# EAGLE design untitled (EAGLE 6.1)
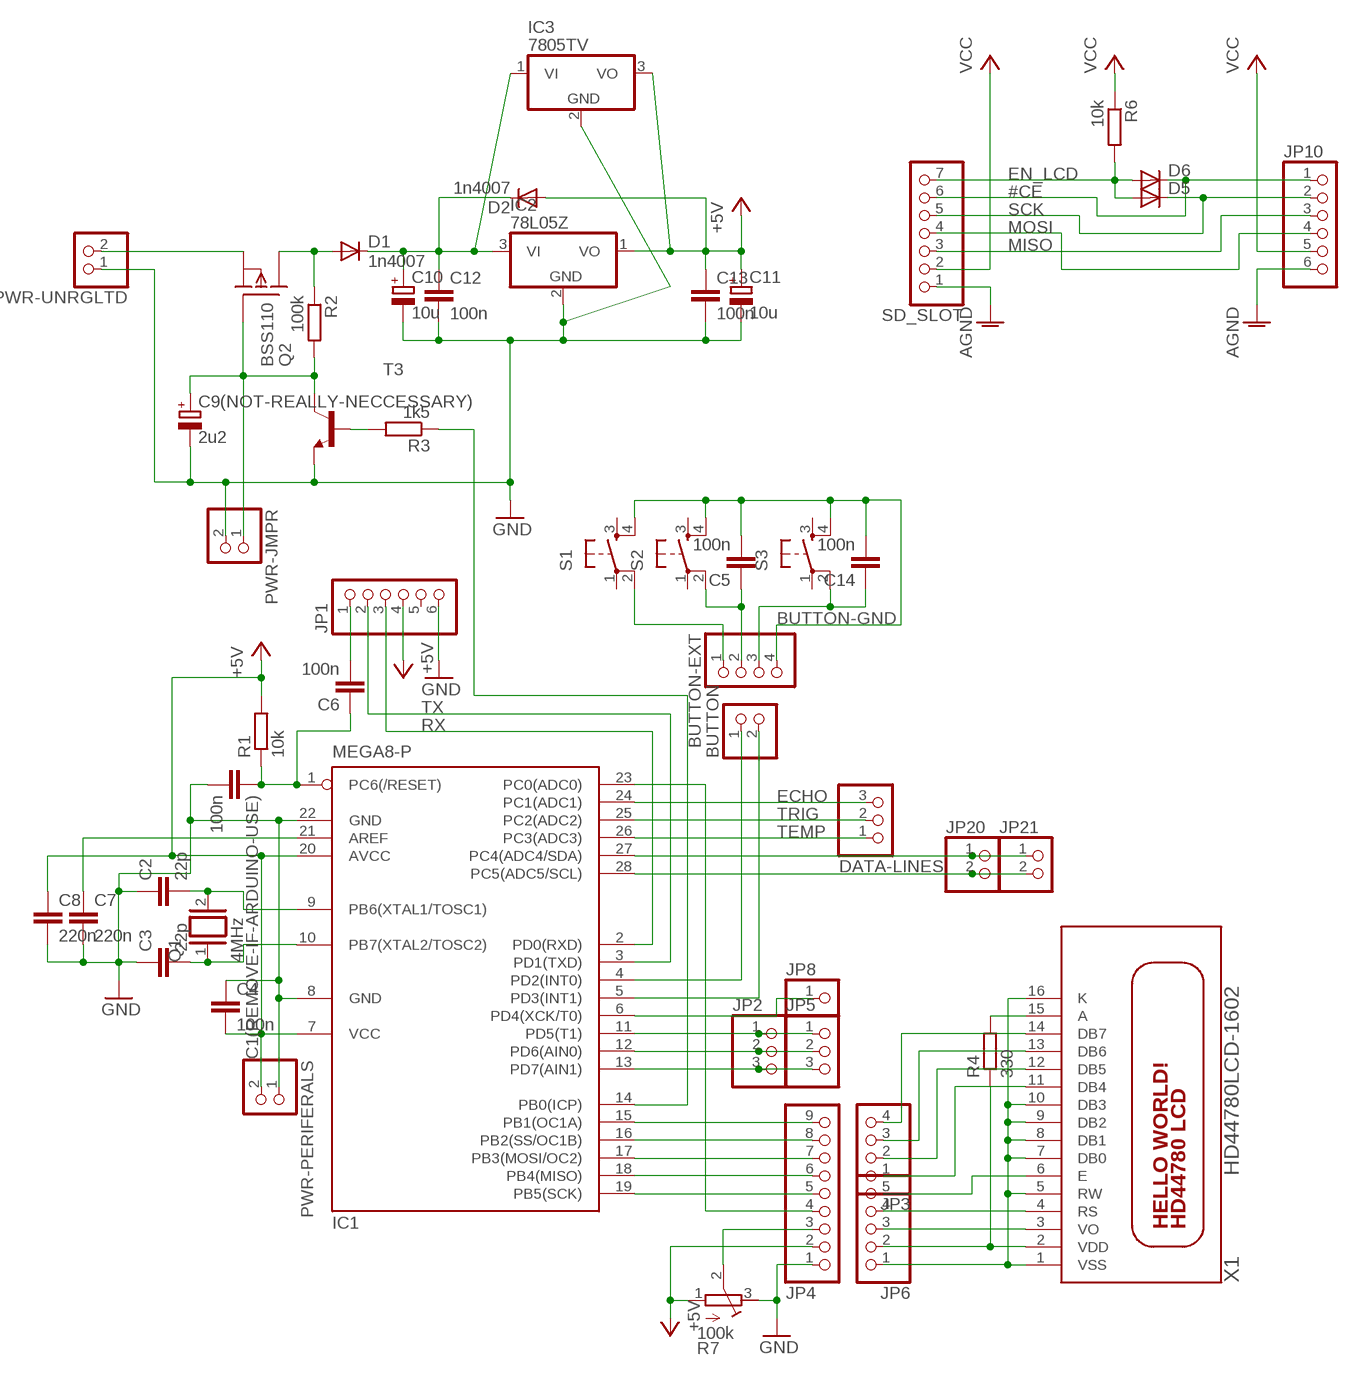
[diagram p0: schematic, sheet 1]

## Parts
BUTTON  PINHD-1X2  [1X02]
BUTTON-EXT  PINHD-1X4  [1X04]
C1(REMOVE-IF-ARDUINO-USE)  100n  C-EU025-025X050  [C025-025X050]
C2  22p  C-EU025-025X050  [C025-025X050]
C3  22p  C-EU025-025X050  [C025-025X050]
C4  100n  C-EU025-025X050  [C025-025X050]
C5  100n  C-EU025-025X050  [C025-025X050]
C6  100n  C-EU025-025X050  [C025-025X050]
C7  220n  C-EU025-025X050  [C025-025X050]
C8  220n  C-EU025-025X050  [C025-025X050]
C9(NOT-REALLY-NECCESSARY)  2u2  CPOL-EUE2.5-6  [E2,5-6]
C10  10u  CPOL-EUE2.5-6  [E2,5-6]
C11  10u  CPOL-EUE5-9VAXIAL  [E5R]
C12  100n  C-EU025-025X050  [C025-025X050]
C13  100n  C-EU025-025X050  [C025-025X050]
C14  100n  C-EU025-025X050  [C025-025X050]
D1  1n4007  DIODE-D-2.5  [D-2.5]
D2  1n4007  DIODE-D-2.5  [D-2.5]
D5  DIODE-D-5  [D-5]
D6  DIODE-D-2.5  [D-2.5]
DATA-LINES  PINHD-1X3  [1X03]
IC1  MEGA8-P  [DIL28-3]
IC2  78L05Z  [TO92]
IC3  7805TV  [TO220V]
JP1  PINHD-1X6  [1X06]
JP2  PINHD-1X3  [1X03]
JP3  PINHD-1X4  [1X04]
JP4  PINHD-1X9  [1X09]
JP5  PINHD-1X3  [1X03]
JP6  PINHD-1X5  [1X05]
JP8  PINHD-1X1  [1X01]
JP10  PINHD-1X6  [1X06]
JP20  PINHD-1X2  [1X02]
JP21  PINHD-1X2  [1X02]
PWR-JMPR  PINHD-1X2  [1X02]
PWR-PERIFERALS  PINHD-1X2  [1X02]
PWR-UNRGLTD  PINHD-1X2  [1X02]
Q1  4MHz  XTAL/S  [QS]
Q2  BSS110  [TO92]
R1  10k  R-EU_0207/2V  [0207/2V]
R2  100k  R-EU_0207/2V  [0207/2V]
R3  1k5  R-EU_0207/2V  [0207/2V]
R4  330  R-EU_0207/10  [0207/10]
R6  10k  R-EU_0207/12  [0207/12]
R7  100k  R-TRIMM64W  [RTRIM64W]
S1  TAC_SWITCHPTH  [TACTILE-PTH]
S2  TAC_SWITCHPTH  [TACTILE-PTH]
S3  TAC_SWITCHPTH  [TACTILE-PTH]
SD_SLOT  PINHD-1X7  [1X07]
T3  BC167-NPN-TO92-ECB  [TO92-ECB]
X1  HD44780LCD-1602  [LCD1602]

## Nets
#CE: D6.C JP10.1 SD_SLOT.6
+5V: C4.2 C8.1 C11.+ C13.1 D2.A IC1.7(VCC) IC1.20(AVCC) IC2.1(VO) IC3.3(VO) JP1.4 JP4.2 PWR-PERIFERALS.2 R1.2 R7.1(A)
AGND: JP10.6 SD_SLOT.1
BUTTON-GND: BUTTON-EXT.4 C5.2 C14.2 S1.4 S2.4 S3.4
ECHO: DATA-LINES.3 IC1.24(PC1(ADC1))
EN_LCD: D5.A D6.A R6.2 SD_SLOT.7
GND: C1(REMOVE-IF-ARDUINO-USE).2 C2.1 C3.1 C4.1 C7.2 C8.2 C9(NOT-REALLY-NECCESSARY).- C10.- C11.- C12.2 C13.2 IC1.8(GND) IC1.22(GND) IC2.2(GND) IC3.2(GND) JP1.6 JP4.1 PWR-JMPR.2 PWR-PERIFERALS.1 PWR-UNRGLTD.1 R7.3(E) T3.E
MISO: JP10.3 SD_SLOT.3
MOSI: JP10.4 SD_SLOT.4
N$1: C6.2 JP1.1
N$2: JP4.3 R7.2(S)
N$3: R4.2 X1.15(A)
N$4: JP3.2 X1.12(DB5)
N$5: JP3.3 X1.13(DB6)
N$6: JP3.4 X1.14(DB7)
N$7: JP3.1 X1.11(DB4)
N$8: JP6.5 X1.6(E)
N$9: IC1.15(PB1(OC1A)) JP4.9
N$10: JP6.4 X1.4(RS)
N$11: JP6.3 X1.3(VO)
N$12: IC1.16(PB2(SS/OC1B)) JP4.8
N$13: IC1.17(PB3(MOSI/OC2)) JP4.7
N$14: IC1.18(PB4(MISO)) JP4.6
N$15: IC1.19(PB5(SCK)) JP4.5
N$16: IC1.23(PC0(ADC0)) JP4.4
N$17: C1(REMOVE-IF-ARDUINO-USE).1 C6.1 IC1.1(PC6(/RESET)) R1.1
N$19: BUTTON.1 IC1.4(PD2(INT0))
N$20: C2.2 IC1.9(PB6(XTAL1/TOSC1)) Q1.2
N$21: C3.2 IC1.10(PB7(XTAL2/TOSC2)) Q1.1
N$22: IC1.13(PD7(AIN1)) JP2.3 JP5.3
N$23: IC1.12(PD6(AIN0)) JP2.2 JP5.2
N$24: C7.1 IC1.21(AREF)
N$25: IC1.11(PD5(T1)) JP2.1 JP5.1
N$27: C9(NOT-REALLY-NECCESSARY).+ PWR-JMPR.1 Q2.2(G) R2.2 T3.C
N$28: R3.2 T3.B
N$29: BUTTON.2 IC1.5(PD3(INT1))
N$30: PWR-UNRGLTD.2 Q2.1(S)
N$31: D1.A Q2.3(D) R2.1
N$32: BUTTON-EXT.3 C14.1 S3.2
N$35: IC1.27(PC4(ADC4/SDA)) JP20.1 JP21.1
N$36: IC1.28(PC5(ADC5/SCL)) JP20.2 JP21.2
N$37: C10.+ C12.1 D1.C D2.C IC2.3(VI) IC3.1(VI)
N$40: IC1.6(PD4(XCK/T0)) JP8.1
N$42: BUTTON-EXT.2 C5.1 S2.2
N$43: IC1.14(PB0(ICP)) R3.1
N$46: BUTTON-EXT.1 S1.2
RX: IC1.2(PD0(RXD)) JP1.3
SCK: D5.C JP10.2 SD_SLOT.5
TEMP: DATA-LINES.1 IC1.26(PC3(ADC3))
TRIG: DATA-LINES.2 IC1.25(PC2(ADC2))
TX: IC1.3(PD1(TXD)) JP1.2
VCC: JP10.5 R6.1 SD_SLOT.2
VDD: JP6.2 R4.1 X1.2(VDD)
VSS: JP6.1 X1.1(VSS) X1.5(RW) X1.7(DB0) X1.8(DB1) X1.9(DB2) X1.10(DB3) X1.16(K)
Unconnected: JP1.5 S1.1 S1.3 S2.1 S2.3 S3.1 S3.3

## Library data of the parts
BUTTON JP20 JP21 PWR-JMPR PWR-PERIFERALS PWR-UNRGLTD = pinhead:PINHD-1X2: PIN HEADER
BUTTON-EXT JP3 = pinhead:PINHD-1X4: PIN HEADER
C1(REMOVE-IF-ARDUINO-USE) C2-C8 C12-C14 = rcl:C-EU: CAPACITOR, European symbol
C9(NOT-REALLY-NECCESSARY) C10 C11 = rcl:CPOL-EU: POLARIZED CAPACITOR, European symbol
D1 D2 D5 D6 = diode:DIODE-: DIODE
DATA-LINES JP2 JP5 = pinhead:PINHD-1X3: PIN HEADER
IC1 = atmel:MEGA8-P: MICROCONTROLLER 8 Kbytes FLASH, 1 kbytes SRAM, 512 bytes EEPROM, USART, 4-channel 10 bit ADC, 2-channel 8 bit ADC Pin compatible with Atmega48, ATMega88, ATMega168 Source: avr.lbr; OC_FARNELL: unknown; OC_NEWARK: unknown
IC2 IC3 = linear:78*: Positive VOLTAGE REGULATOR Source: http://cache.national.com/ds/LM/LM78L05.pdf http://www.fairchildsemi.com/ds/LM/LM7805.pdf
JP1 JP10 = pinhead:PINHD-1X6: PIN HEADER
JP4 = pinhead:PINHD-1X9: PIN HEADER
JP6 = pinhead:PINHD-1X5: PIN HEADER
JP8 = pinhead:PINHD-1X1: PIN HEADER
Q1 = special:XTAL/S: CRYSTAL
Q2 = transistor-fet:BSS110: P-Channel Enhancement MOSFET -50V; -0,17A; 6Ohm
R1-R4 R6 = rcl:R-EU_: RESISTOR, European symbol
R7 = rcl:R-TRIMM: Trimm resistor
S1-S3 = SparkFun:TAC_SWITCH: Momentary Switch Button commonly used for reset or general input. Spark Fun Electronics SKU : COM-00097
SD_SLOT = pinhead:PINHD-1X7: PIN HEADER
T3 = transistor:*-NPN-: NPN Transistror BF959 corrected 2008.03.06
X1 = adafruit:HD44780LCD: HD44780 LCD Standard character type LCDs, available in sizes from 8x1 to 40x4!

## Board
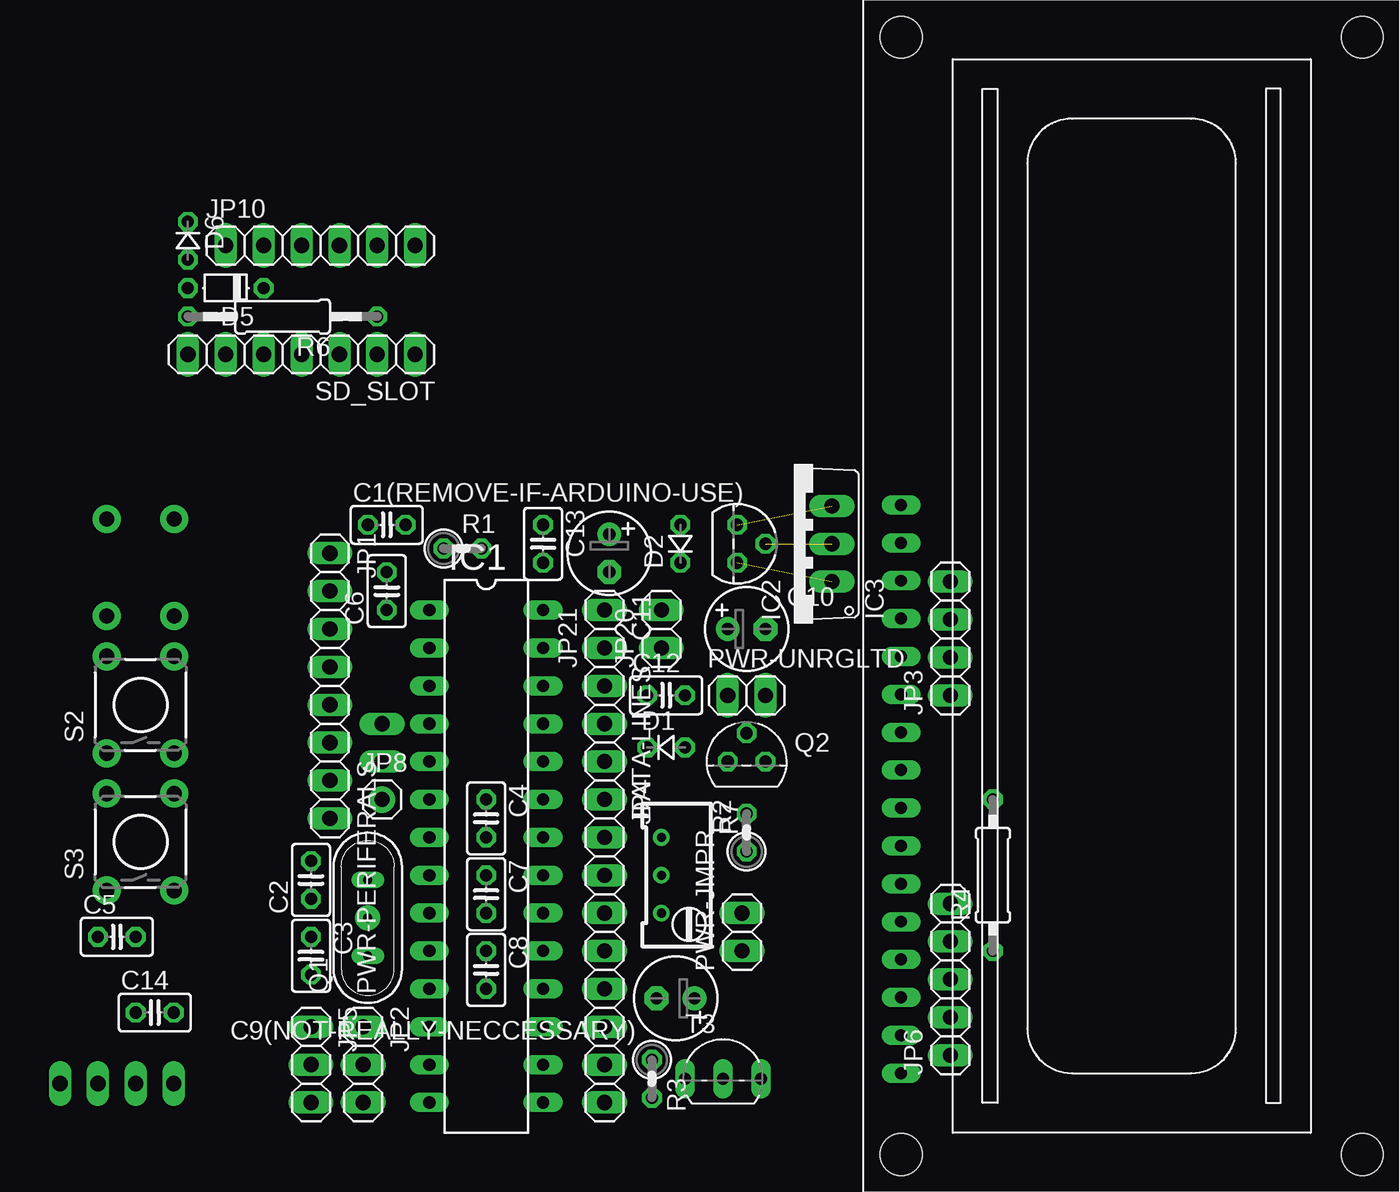
[diagram p1: board, top side]
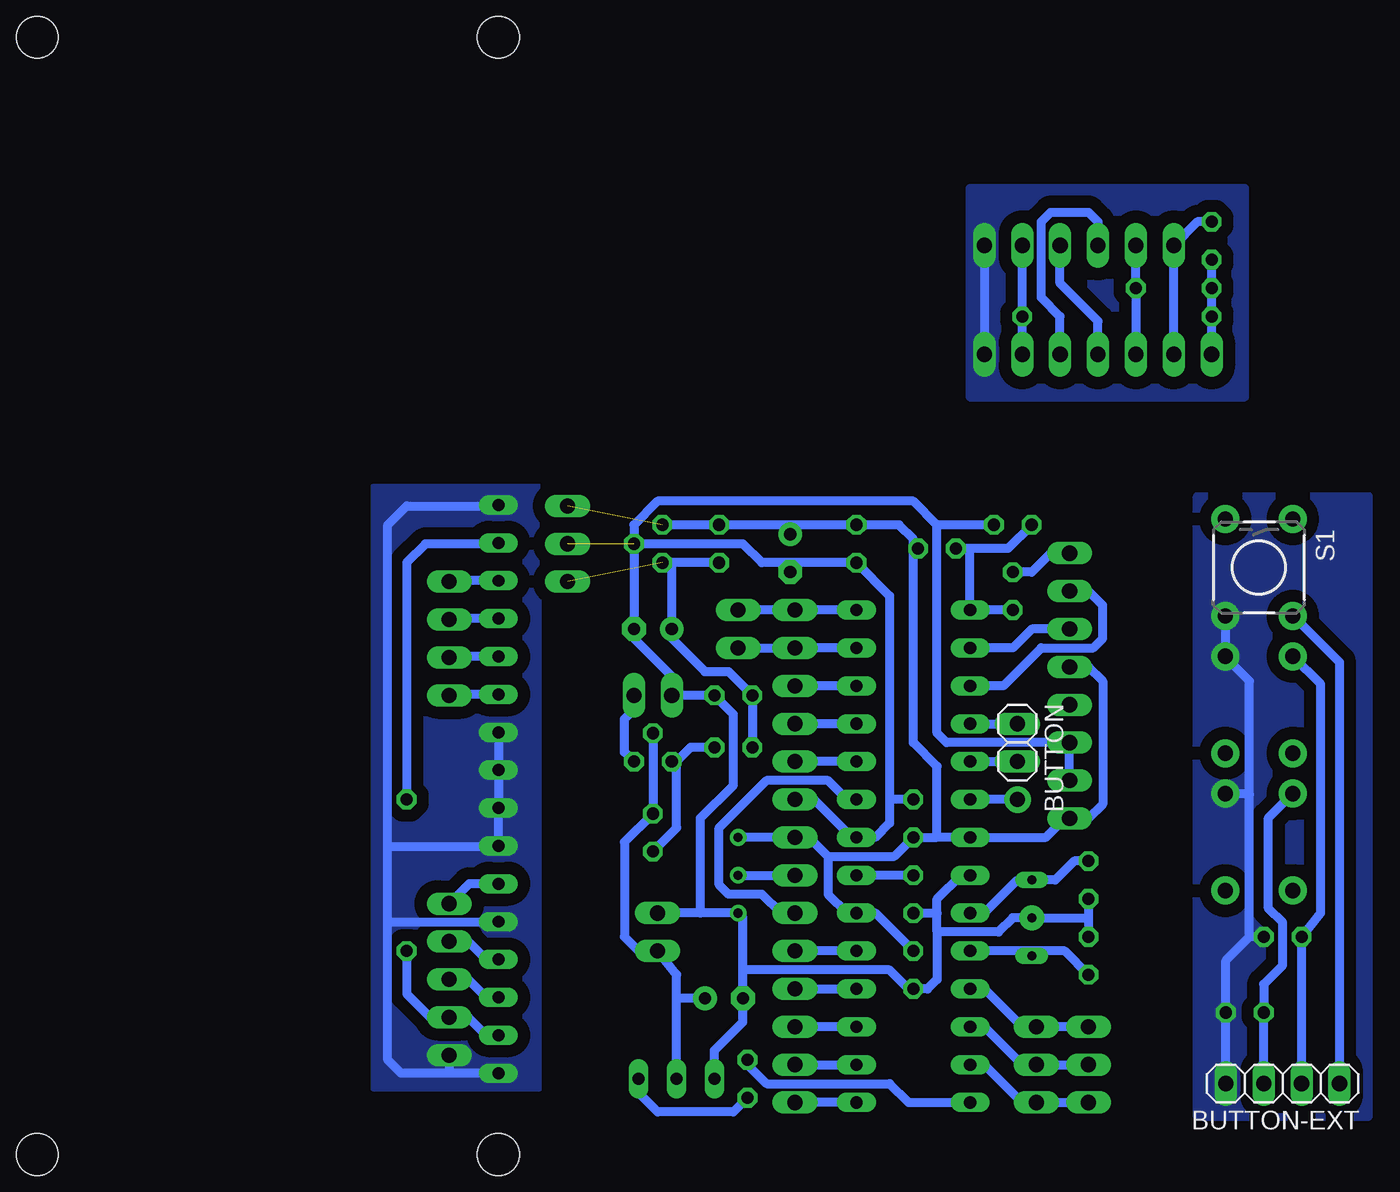
[diagram p2: board, bottom side, seen from below]

No outline drawn. Coordinates in mm, seen from the top.
Copper layers (1*16): Top 0.035mm / dielectric 1.5mm / Bottom 0.035mm
Design rules: minimum track width 10mil, minimum drill 24mil, track to track 8mil, track to pad 8mil, pad to pad 8mil, via to via 8mil, smd to smd 8mil, copper to edge 40mil, drill to drill 8mil, minimum pad ring 10mil, minimum via ring 8mil, stop-mask expansion 4mil, vias tented up to drill 0mil, thermal gap 10mil

### Footprints (pad centres in the part's own frame; a part is rotated, then mirrored left to right if it is on the bottom)
1X02 = drill 1.016 long: 1 -1.27,0; 2 1.27,0
1X04 = drill 1.016 long: 1 -3.81,0; 2 -1.27,0; 3 1.27,0; 4 3.81,0
C025-025X050 = drill 0.813 octagon: 1 -1.27,0; 2 1.27,0
E2,5-6 = drill 0.813 pad 1.6: + -1.27,0 | drill 0.813 pad 1.6 octagon: - 1.27,0
D-2.5 = drill 0.813 octagon: A 1.27,0; C -1.27,0
D-5 = drill 0.813 octagon: A 2.54,0; C -2.54,0
1X03 = drill 1.016 long: 1 -2.54,0; 2 0,0; 3 2.54,0
DIL28-3 = drill 0.813 long: 1 -16.51,-3.81; 2 -13.97,-3.81; 3 -11.43,-3.81; 4 -8.89,-3.81; 5 -6.35,-3.81; 6 -3.81,-3.81; 7 -1.27,-3.81; 8 1.27,-3.81; 9 3.81,-3.81; 10 6.35,-3.81; 11 8.89,-3.81; 12 11.43,-3.81; 13 13.97,-3.81; 14 16.51,-3.81; 15 16.51,3.81; 16 13.97,3.81; 17 11.43,3.81; 18 8.89,3.81; 19 6.35,3.81; 20 3.81,3.81; 21 1.27,3.81; 22 -1.27,3.81; 23 -3.81,3.81; 24 -6.35,3.81; 25 -8.89,3.81; 26 -11.43,3.81; 27 -13.97,3.81; 28 -16.51,3.81
TO92 = drill 0.813 octagon: 1 -1.27,0; 2 0,1.905; 3 1.27,0
TO220V = drill 1.016 long: 1 -2.54,-2.54; 2 0,-2.54; 3 2.54,-2.54
1X06 = drill 1.016 long: 1 -6.35,0; 2 -3.81,0; 3 -1.27,0; 4 1.27,0; 5 3.81,0; 6 6.35,0
1X09 = drill 1.016 long: 1 -10.16,0; 2 -7.62,0; 3 -5.08,0; 4 -2.54,0; 5 0,0; 6 2.54,0; 7 5.08,0; 8 7.62,0; 9 10.16,0
1X05 = drill 1.016 long: 1 -5.08,0; 2 -2.54,0; 3 0,0; 4 2.54,0; 5 5.08,0
1X01 = drill 1.016 octagon: 1 0,0
QS = drill 0.61 long: 1 -2.54,0; 2 2.54,0
TO92' = drill 0.813 octagon: 1 1.27,0; 2 0,1.905; 3 -1.27,0
0207/2V = drill 0.813 octagon: 1 -1.27,0; 2 1.27,0
0207/10 = drill 0.813 octagon: 1 -5.08,0; 2 5.08,0
0207/12 = drill 0.813 octagon: 1 -6.35,0; 2 6.35,0
RTRIM64W = drill 0.61: 1 1.27,-2.54; 2 1.27,0; 3 1.27,2.54
TACTILE-PTH = drill 1.016 pad 1.88: 1 -3.251,2.261; 2 3.251,2.261; 3 -3.251,-2.261; 4 3.251,-2.261
1X07 = drill 1.016 long: 1 -7.62,0; 2 -5.08,0; 3 -2.54,0; 4 0,0; 5 2.54,0; 6 5.08,0; 7 7.62,0
TO92-ECB = drill 0.813 long: B 2.54,0; C 0,0; E -2.54,0
LCD1602 = drill 0.8 long: 1 8,33.46; 2 10.54,33.46; 3 13.08,33.46; 4 15.62,33.46; 5 18.16,33.46; 6 20.7,33.46; 7 23.24,33.46; 8 25.78,33.46; 9 28.32,33.46; 10 30.86,33.46; 11 33.4,33.46; 12 35.94,33.46; 13 38.48,33.46; 14 41.02,33.46; 15 43.56,33.46; 16 46.1,33.46 | hole 2.8: 2.54,2.54; 2.54,33.46; 77.46,33.46; 77.46,2.54

### Placement (x,y rotation side)
BUTTON  63.5,40.96 270 bottom
BUTTON-EXT  45.72,18.1 180 bottom
C1(REMOVE-IF-ARDUINO-USE)  63.82,55.56 0 top
C2  58.74,31.75 90 top
C3  58.74,26.67 270 top
C4  70.48,35.88 270 top
C5  45.72,27.94 0 top
C6  63.82,51.12 90 top
C7  70.48,30.8 270 top
C8  70.48,25.72 270 top
C9(NOT-REALLY-NECCESSARY)  83.19,23.81 180 top
C10  87.95,48.58 0 top
C11  10u  [E2,5-6]  78.74,53.66 270 top
C12  82.55,44.13 0 top
C13  74.3,54.29 270 top
C14  48.26,22.86 0 top
D1  82.55,40.64 0 top
D2  83.5,54.29 90 top
D5  53.02,71.44 180 top
D6  50.48,74.61 270 top
DATA-LINES  78.42,42.23 270 top
IC1  70.48,33.34 270 top
IC2  87.31,54.29 270 top
IC3  91.12,54.29 90 top
JP1  60.01,47.31 270 top
JP2  62.23,19.37 270 top
JP3  101.6,47.94 90 top
JP4  78.42,26.99 270 top
JP5  58.74,19.37 270 top
JP6  101.6,25.08 90 top
JP8  63.5,37.15 0 top
JP10  59.37,74.3 0 top
JP20  82.23,48.58 90 top
JP21  78.42,48.58 90 top
PWR-JMPR  87.63,28.26 90 top
PWR-PERIFERALS  60.01,37.15 270 top
PWR-UNRGLTD  87.95,44.13 0 top
Q1  62.55,29.21 90 top
Q2  BSS110  [TO92']  87.95,39.69 0 top
R1  68.9,53.98 0 top
R2  87.95,34.92 90 top
R3  81.6,18.41 270 top
R4  104.46,32.07 90 top
R6  56.83,69.53 180 top
R7  83.5,32.07 180 top
S1  47.31,52.7 270 bottom
S2  47.31,43.5 90 top
S3  47.31,34.29 90 top
SD_SLOT  58.1,66.99 180 top
T3  86.36,18.41 0 top
X1  131.76,10.79 90 top

### Tracks (layer width: path | path; a pad name or v marks a point on that pad's centre or on a via)
#CE
  Bottom 0.61: D6.C 51.44,75.88 JP10.1 SD_SLOT.6
+5V  (1 unrouted)
  Bottom 0.61: 68.9,34.61 IC1.7 61.59,34.61 60.33,35.88 PWR-PERIFERALS.2 58.74,35.88 57.78,36.83 57.78,45.09 58.74,46.04 JP1.4 | IC2.1 D2.A 78.74,55.56 | 68.9,34.61 68.9,39.37 70.48,40.96 70.48,53.98 | 76.2,33.34 71.75,33.34 C4.2 68.9,34.61 | C8.1 73.03,29.53 IC1.20 74.93,29.53 76.2,30.8 76.2,33.34 | 76.2,33.34 77.47,34.61 JP4.2 R7.1 | R1.2 70.48,53.98 | 70.48,53.98 70.48,54.61 71.44,55.56 C13.1 78.74,55.56 | C11.+ 78.74,55.56
AGND
  Bottom 0.61: JP10.6 SD_SLOT.1
  pour Bottom (isolate 0.813, no thermals): 48.26,78.11 66.67,78.11 66.67,64.14 48.26,64.14
BUTTON-GND
  Bottom 0.61: BUTTON-EXT.4 C14.2 49.53,26.35 47.94,27.94 | 47.94,27.94 47.94,37.47 | C5.2 47.94,27.94 | S3.4 48.02,37.54 47.94,37.47 | 47.94,37.47 47.94,45.09 49.57,46.71 S2.4 S1.4
  pour Bottom (isolate 0.813, no thermals): 40.01,15.88 51.44,15.88 51.44,57.47 40.01,57.47
ECHO
  Bottom 0.61: IC1.24 DATA-LINES.3
EN_LCD
  Bottom 0.61: SD_SLOT.7 R6.2 D5.A D6.A
GND  (via drill 0.6 pad 1.68)  (1 unrouted)
  Bottom 0.61: 68.9,28.26 64.77,28.26 63.82,29.21 v62.55,29.21 58.74,29.21 | 68.9,28.26 68.9,29.53 | 68.9,29.53 68.9,30.48 67.31,32.07 IC1.8 | IC2.2 81.92,54.29 80.64,53.02 78.74,53.02 | C4.1 72.07,37.15 | C7.2 68.9,29.53 | JP4.1 77.15,37.15 74.61,34.61 IC1.22 73.03,34.61 72.07,35.56 72.07,37.15 | IC2.2 88.9,54.29 | C2.1 58.74,29.21 | 58.74,29.21 C3.1 | PWR-PERIFERALS.1 JP1.6 68.26,40.96 68.9,41.59 68.9,55.56 | 72.07,37.15 72.07,50.8 C13.2 78.74,53.02 | 68.9,28.26 68.9,25.08 69.53,24.45 C8.2 70.8,24.45 72.07,25.72 81.92,25.72 | 84.77,29.53 84.77,35.88 82.55,38.1 82.55,42.86 C12.2 PWR-UNRGLTD.1 86.68,45.4 89.22,47.94 C10.- IC2.2 | 81.92,25.72 C9(NOT-REALLY-NECCESSARY).- 81.92,22.23 83.82,20.32 T3.E | 81.92,25.72 81.92,29.21 R7.3 84.77,29.53 | C1(REMOVE-IF-ARDUINO-USE).2 68.9,55.56 | 68.9,55.56 70.48,57.15 87.63,57.15 89.22,55.56 IC2.2 | C11.- 78.74,53.02 | 84.77,29.53 PWR-JMPR.2
MISO
  Bottom 0.61: SD_SLOT.3 60.64,69.53 61.91,70.8 61.91,75.88 61.28,76.52 58.74,76.52 58.1,75.88 JP10.3
MOSI
  Bottom 0.61: SD_SLOT.4 58.1,69.22 60.64,71.75 JP10.4
N$1
  Bottom 0.61: JP1.1 61.28,53.66 62.55,52.39 C6.2
N$2
  Bottom 0.61: R7.2 JP4.3
N$3
  Bottom 0.61: X1.15 98.36,54.29 103.19,54.29 104.46,53.02 R4.2
N$4
  Bottom 0.61: X1.12 101.54,46.73 JP3.2
N$5
  Bottom 0.61: X1.13 101.54,49.27 JP3.3
N$6
  Bottom 0.61: X1.14 101.54,51.81 JP3.4
N$7
  Bottom 0.61: X1.11 101.54,44.2 JP3.1
N$8
  Bottom 0.61: X1.6 100.27,31.5 JP6.5
N$9
  Bottom 0.61: IC1.15 JP4.9
N$10
  Bottom 0.61: X1.4 99.12,26.41 100.33,27.62 JP6.4
N$11
  Bottom 0.61: X1.3 99.12,23.88 100.33,25.08 JP6.3
N$12
  Bottom 0.61: JP4.8 IC1.16
N$13
  Bottom 0.61: IC1.17 JP4.7
N$14
  Bottom 0.61: JP4.6 IC1.18
N$15
  Bottom 0.61: IC1.19 JP4.5
N$16
  Bottom 0.61: IC1.23 74.93,37.15 76.2,38.42 80.33,38.42 83.5,35.24 83.5,31.43 82.87,30.8 80.64,30.8 79.38,29.53 JP4.4
N$17
  Bottom 0.61: 66.67,53.98 R1.1 | 66.67,53.98 IC1.1 C6.1 | C1(REMOVE-IF-ARDUINO-USE).1 64.14,53.98 66.67,53.98
N$19
  Bottom 0.61: IC1.4 BUTTON.1
N$20
  Bottom 0.61: IC1.9 65.72,29.53 63.5,31.75 Q1.2 60.96,31.75 59.69,33.02 C2.2
N$21
  Bottom 0.61: C3.2 60.33,26.99 62.55,26.99 | 62.55,26.99 IC1.10 | Q1.1 62.55,26.99
N$22
  Bottom 0.61: IC1.13 65.72,19.37 63.5,17.14 JP2.3 JP5.3
N$23
  Bottom 0.61: IC1.12 65.72,21.91 63.5,19.68 JP2.2 JP5.2
N$24
  Bottom 0.61: C7.1 IC1.21
N$25
  Bottom 0.61: JP5.1 JP2.1 63.5,22.23 65.72,24.45 IC1.11
N$27
  Bottom 0.61: Q2.2 R2.2 89.85,34.29 89.85,27.94 88.9,26.99 PWR-JMPR.1 86.36,25.4 86.36,23.81 | T3.C 86.36,23.81 | C9(NOT-REALLY-NECCESSARY).+ 86.36,23.81
N$28
  Bottom 0.61: R3.2 82.55,16.19 87.63,16.19 88.9,17.46 T3.B
N$29
  Bottom 0.61: IC1.5 BUTTON.2
N$30
  Bottom 0.61: Q2.1 89.85,40.32 89.85,42.55 89.22,43.18 PWR-UNRGLTD.2
N$31
  Bottom 0.61: D1.A 85.41,40.64 86.36,39.69 | R2.1 86.36,35.24 86.36,39.69 | 86.36,39.69 Q2.3
N$32
  Bottom 0.61: BUTTON-EXT.3 C14.1 46.99,24.77 45.72,26.04 45.72,28.89 46.67,29.84 46.67,35.92 S3.2
N$35
  Bottom 0.61: IC1.27 JP21.1 JP20.1
N$36
  Bottom 0.61: IC1.28 JP21.2 JP20.2
N$37  (1 unrouted)
  Bottom 0.61: D2.C 86.68,53.02 | 86.68,53.02 IC2.3 | D1.C C12.1 82.87,45.72 84.45,45.72 86.68,47.94 C10.+ 86.68,53.02
N$40
  Bottom 0.61: JP8.1 IC1.6
N$42
  Bottom 0.61: BUTTON-EXT.2 C5.1 43.18,29.53 43.18,44.88 S2.2 45.05,46.71
N$43
  Bottom 0.61: IC1.14 70.8,16.83 72.07,18.1 80.33,18.1 81.6,19.37 R3.1
N$45  (via drill 0.6 pad 1.78)
  other vias: 63.5,37.15
N$46
  Bottom 0.61: S1.2 45.01,49.45 41.91,46.35 BUTTON-EXT.1
RX
  Bottom 0.61: JP1.3 62.55,48.58 63.82,47.31 IC1.2
SCK
  Bottom 0.61: SD_SLOT.5 D5.C JP10.2
TEMP
  Bottom 0.61: IC1.26 DATA-LINES.1
TRIG
  Bottom 0.61: IC1.25 DATA-LINES.2
TX
  Bottom 0.61: IC1.3 64.45,44.77 61.91,47.31 58.42,47.31 57.78,47.94 57.78,50.16 58.74,51.12 JP1.2
VCC
  Bottom 0.61: SD_SLOT.2 R6.1 JP10.5
VDD
  Bottom 0.61: X1.2 99.12,21.34 100.33,22.54 JP6.2 102.87,22.54 104.46,24.13 R4.1
VSS
  Bottom 0.61: X1.16 98.36,56.83 104.46,56.83 105.73,55.56 105.73,33.97 | 105.73,28.89 105.73,19.68 104.84,18.8 101.6,18.8 | 105.73,28.89 105.73,33.97 | X1.1 101.6,18.8 | JP6.1 101.6,18.8 | X1.10 X1.9 X1.8 98.3,33.97 105.73,33.97 | X1.5 98.3,28.89 105.73,28.89
  pour Bottom (isolate 0.813, no thermals): 95.57,58.1 106.68,58.1 106.68,17.78 95.57,17.78